# EAGLE schematic avr_sample_hx711 (EAGLE 6.6.0)
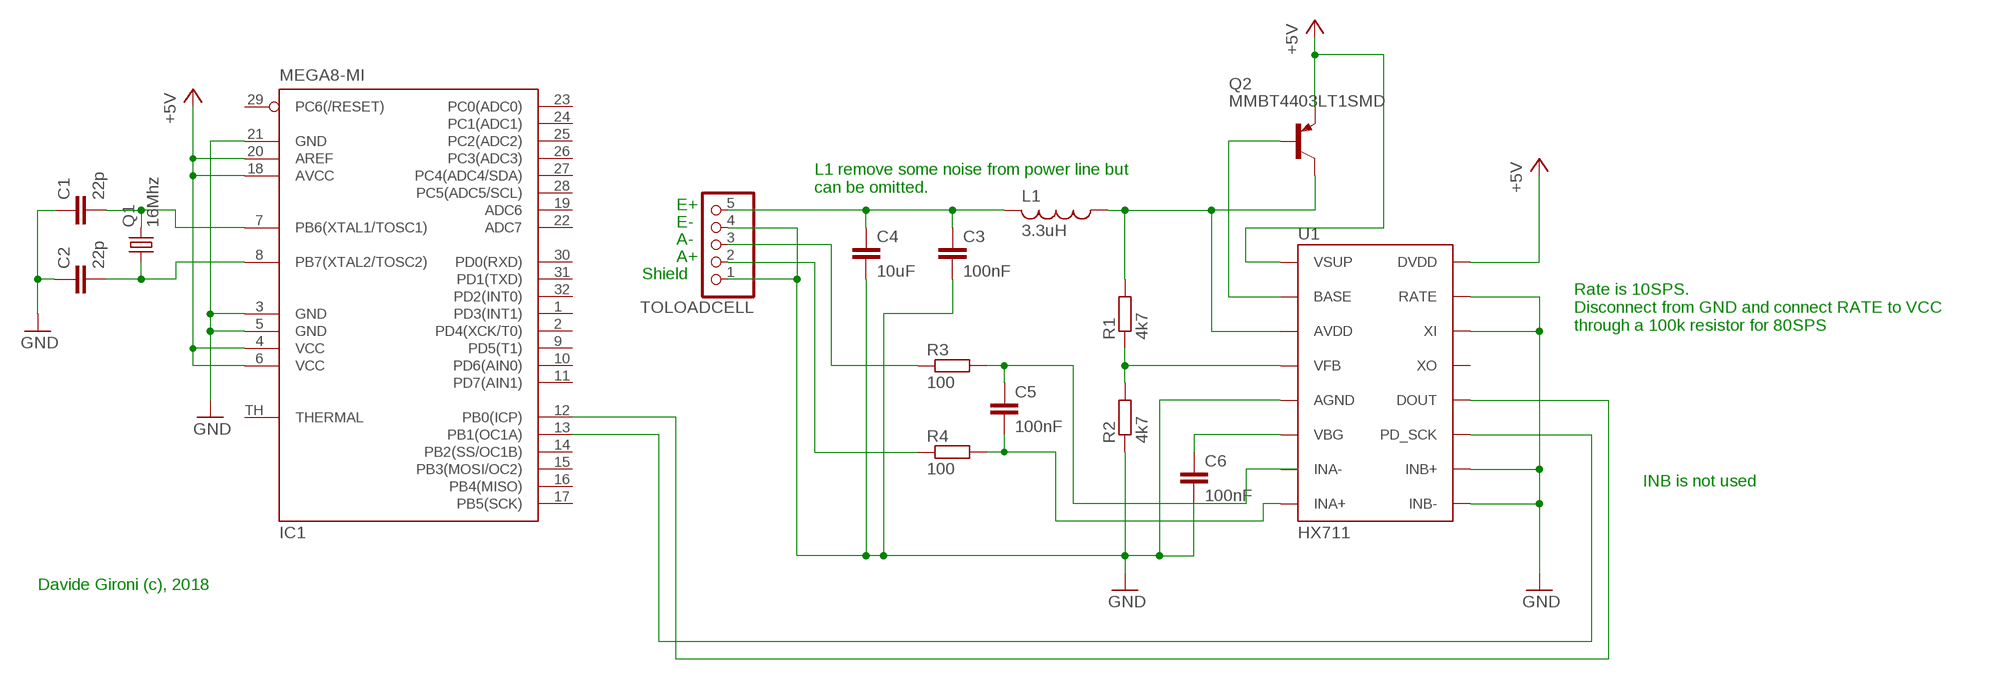
[diagram p0: schematic, sheet 1]

## Parts
C1  22p  C-EUC0805  [C0805]
C2  22p  C-EUC0805  [C0805]
C3  100nF  C-EUC0805  [C0805]
C4  10uF  C-EUC0805  [C0805]
C5  100nF  C-EUC0805  [C0805]
C6  100nF  C-EUC0805  [C0805]
IC1  MEGA8-MI  [MLF32-TH]
L1  3.3uH  L-USL4532C  [L4532M]
Q1  16Mhz  CRYSTALHC33U-V  [HC33U-V]
Q2  MMBT4403LT1SMD  [SOT23-BEC]
R1  4k7  R-EU_R0603  [R0603]
R2  4k7  R-EU_R0603  [R0603]
R3  100  R-EU_R0603  [R0603]
R4  100  R-EU_R0603  [R0603]
TOLOADCELL  PINHD-1X5  [1X05]
U1  HX711  HX711HX711  [SO16]

## Nets
+5V: IC1.4(VCC) IC1.6(VCC) IC1.18(AVCC) IC1.20(AREF) Q2.E U1.1(VSUP) U1.16(DVDD)
GND: C1.1 C2.1 C3.2 C4.2 C6.2 IC1.3(GND) IC1.5(GND) IC1.21(GND) R2.1 TOLOADCELL.1 TOLOADCELL.4 U1.5(AGND) U1.9(INB-) U1.10(INB+) U1.14(XI) U1.15(RATE)
N$1: C1.2 IC1.7(PB6(XTAL1/TOSC1)) Q1.2
N$2: C2.2 IC1.8(PB7(XTAL2/TOSC2)) Q1.1
N$3: R1.1 R2.2 U1.4(VFB)
N$4: L1.1 Q2.C R1.2 U1.3(AVDD)
N$5: Q2.B U1.2(BASE)
N$6: C3.1 C4.1 L1.2 TOLOADCELL.5
N$7: IC1.13(PB1(OC1A)) U1.11(PD_SCK)
N$8: IC1.12(PB0(ICP)) U1.12(DOUT)
N$9: C6.1 U1.6(VBG)
N$10: C5.1 R3.2
N$11: C5.2 R4.2 U1.8(INA+)
N$12: R3.1 TOLOADCELL.3
N$13: R4.1 TOLOADCELL.2
Unconnected: IC1.1(PD3(INT1)) IC1.2(PD4(XCK/T0)) IC1.9(PD5(T1)) IC1.10(PD6(AIN0)) IC1.11(PD7(AIN1)) IC1.14(PB2(SS/OC1B)) IC1.15(PB3(MOSI/OC2)) IC1.16(PB4(MISO)) IC1.17(PB5(SCK)) IC1.19(ADC6) IC1.22(ADC7) IC1.23(PC0(ADC0)) IC1.24(PC1(ADC1)) IC1.25(PC2(ADC2)) IC1.26(PC3(ADC3)) IC1.27(PC4(ADC4/SDA)) IC1.28(PC5(ADC5/SCL)) IC1.29(PC6(/RESET)) IC1.30(PD0(RXD)) IC1.31(PD1(TXD)) IC1.32(PD2(INT0)) IC1.TH(THERMAL) U1.7(INA-) U1.13(XO)

## Notes on the sheet
- L1 remove some noise from power line but
  can be omitted.
- E+
- E-
- A-
- A+
- Shield
- Rate is 10SPS.
  Disconnect from GND and connect RATE to VCC
  through a 100k resistor for 80SPS
- INB is not used
- Davide Gironi (c), 2018

## Library data of the parts
C1-C6 = rcl:C-EU: CAPACITOR, European symbol
IC1 = atmel:MEGA8-MI: MICROCONTROLLER 8 Kbytes FLASH, 1 kbytes SRAM, 512 bytes EEPROM, USART, 6-channel 10 bit ADC, 2-channel 8 bit ADC Pin compatible with Atmega48, ATMega88, ATMega168 Source: avr.lbr; MPN: ATMEGA88PA-MU; OC_FARNELL: 1715491; OC_NEWARK: 15R0272
L1 = rcl:L-US: INDUCTOR, American symbol
Q1 = crystal:CRYSTAL: CRYSTAL; OC_FARNELL: unknown; OC_NEWARK: unknown
Q2 = transistor-pnp:MMBT4403*: PNP Transistror
R1-R4 = resistor:R-EU_: RESISTOR, European symbol
TOLOADCELL = pinhead:PINHD-1X5: PIN HEADER
U1 = HX711:HX711; PROD_ID: IC-12445